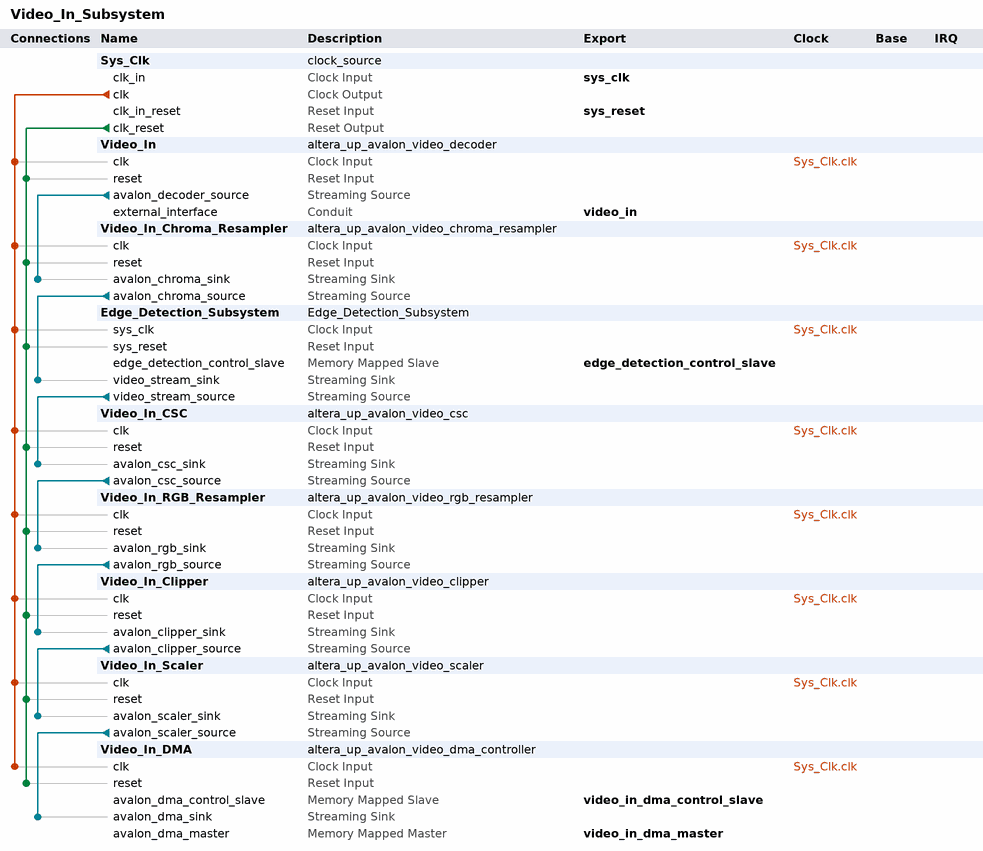
[diagram p0: system contents]
# Platform Designer (Qsys) system Video_In_Subsystem, Cyclone V 5CSEMA5F31C6
# Parameters at their usual value, and those the tool derives, are not listed.
package require -exact qsys 18.0
create_system Video_In_Subsystem
set_project_property DEVICE_FAMILY {Cyclone V}
set_project_property DEVICE 5CSEMA5F31C6

add_instance Sys_Clk clock_source 18.0
set_instance_parameter_value Sys_Clk clockFrequency 50000000
set_instance_parameter_value Sys_Clk clockFrequencyKnown false

add_instance Video_In altera_up_avalon_video_decoder 18.0

add_instance Video_In_Chroma_Resampler altera_up_avalon_video_chroma_resampler 18.0

add_instance Edge_Detection_Subsystem Edge_Detection_Subsystem 1.0

add_instance Video_In_CSC altera_up_avalon_video_csc 18.0

add_instance Video_In_RGB_Resampler altera_up_avalon_video_rgb_resampler 18.0
set_instance_parameter_value Video_In_RGB_Resampler alpha 1023
set_instance_parameter_value Video_In_RGB_Resampler input_type {24-bit RGB}
set_instance_parameter_value Video_In_RGB_Resampler output_type {16-bit RGB}

add_instance Video_In_Clipper altera_up_avalon_video_clipper 18.0
set_instance_parameter_value Video_In_Clipper color_bits 16
set_instance_parameter_value Video_In_Clipper color_planes 1

add_instance Video_In_Scaler altera_up_avalon_video_scaler 18.0
set_instance_parameter_value Video_In_Scaler color_bits 16
set_instance_parameter_value Video_In_Scaler color_planes 1
set_instance_parameter_value Video_In_Scaler height_scaling 1
set_instance_parameter_value Video_In_Scaler width_in 640
set_instance_parameter_value Video_In_Scaler width_scaling 0.5

add_instance Video_In_DMA altera_up_avalon_video_dma_controller 18.0
set_instance_parameter_value Video_In_DMA addr_mode X-Y
set_instance_parameter_value Video_In_DMA back_start_address 134217728
set_instance_parameter_value Video_In_DMA color_bits 16
set_instance_parameter_value Video_In_DMA color_planes 1
set_instance_parameter_value Video_In_DMA dma_enabled false
set_instance_parameter_value Video_In_DMA height 240
set_instance_parameter_value Video_In_DMA mode {From Stream to Memory}
set_instance_parameter_value Video_In_DMA start_address 134217728
set_instance_parameter_value Video_In_DMA width 320

# connections
add_connection Sys_Clk.clk Edge_Detection_Subsystem.sys_clk clock
add_connection Sys_Clk.clk Video_In.clk clock
add_connection Sys_Clk.clk Video_In_Chroma_Resampler.clk clock
add_connection Sys_Clk.clk Video_In_Clipper.clk clock
add_connection Sys_Clk.clk Video_In_CSC.clk clock
add_connection Sys_Clk.clk Video_In_DMA.clk clock
add_connection Sys_Clk.clk Video_In_RGB_Resampler.clk clock
add_connection Sys_Clk.clk Video_In_Scaler.clk clock
add_connection Sys_Clk.clk_reset Edge_Detection_Subsystem.sys_reset reset
add_connection Sys_Clk.clk_reset Video_In.reset reset
add_connection Sys_Clk.clk_reset Video_In_Chroma_Resampler.reset reset
add_connection Sys_Clk.clk_reset Video_In_Clipper.reset reset
add_connection Sys_Clk.clk_reset Video_In_CSC.reset reset
add_connection Sys_Clk.clk_reset Video_In_DMA.reset reset
add_connection Sys_Clk.clk_reset Video_In_RGB_Resampler.reset reset
add_connection Sys_Clk.clk_reset Video_In_Scaler.reset reset
add_connection Edge_Detection_Subsystem.video_stream_source Video_In_CSC.avalon_csc_sink avalon_streaming
add_connection Video_In.avalon_decoder_source Video_In_Chroma_Resampler.avalon_chroma_sink avalon_streaming
add_connection Video_In_Chroma_Resampler.avalon_chroma_source Edge_Detection_Subsystem.video_stream_sink avalon_streaming
add_connection Video_In_Clipper.avalon_clipper_source Video_In_Scaler.avalon_scaler_sink avalon_streaming
add_connection Video_In_CSC.avalon_csc_source Video_In_RGB_Resampler.avalon_rgb_sink avalon_streaming
add_connection Video_In_RGB_Resampler.avalon_rgb_source Video_In_Clipper.avalon_clipper_sink avalon_streaming
add_connection Video_In_Scaler.avalon_scaler_source Video_In_DMA.avalon_dma_sink avalon_streaming

# exported interfaces
add_interface edge_detection_control_slave avalon slave
set_interface_property edge_detection_control_slave EXPORT_OF Edge_Detection_Subsystem.edge_detection_control_slave
add_interface sys_clk clock sink
set_interface_property sys_clk EXPORT_OF Sys_Clk.clk_in
add_interface sys_reset reset sink
set_interface_property sys_reset EXPORT_OF Sys_Clk.clk_in_reset
add_interface video_in conduit end
set_interface_property video_in EXPORT_OF Video_In.external_interface
add_interface video_in_dma_control_slave avalon slave
set_interface_property video_in_dma_control_slave EXPORT_OF Video_In_DMA.avalon_dma_control_slave
add_interface video_in_dma_master avalon master
set_interface_property video_in_dma_master EXPORT_OF Video_In_DMA.avalon_dma_master

set_interconnect_requirement {$system} qsys_mm.clockCrossingAdapter HANDSHAKE
set_interconnect_requirement {$system} qsys_mm.enableEccProtection FALSE
set_interconnect_requirement {$system} qsys_mm.insertDefaultSlave FALSE
set_interconnect_requirement {$system} qsys_mm.maxAdditionalLatency 1

save_system Video_In_Subsystem.qsys
